# Altium project LightMusicProject_r002.PrjPCB
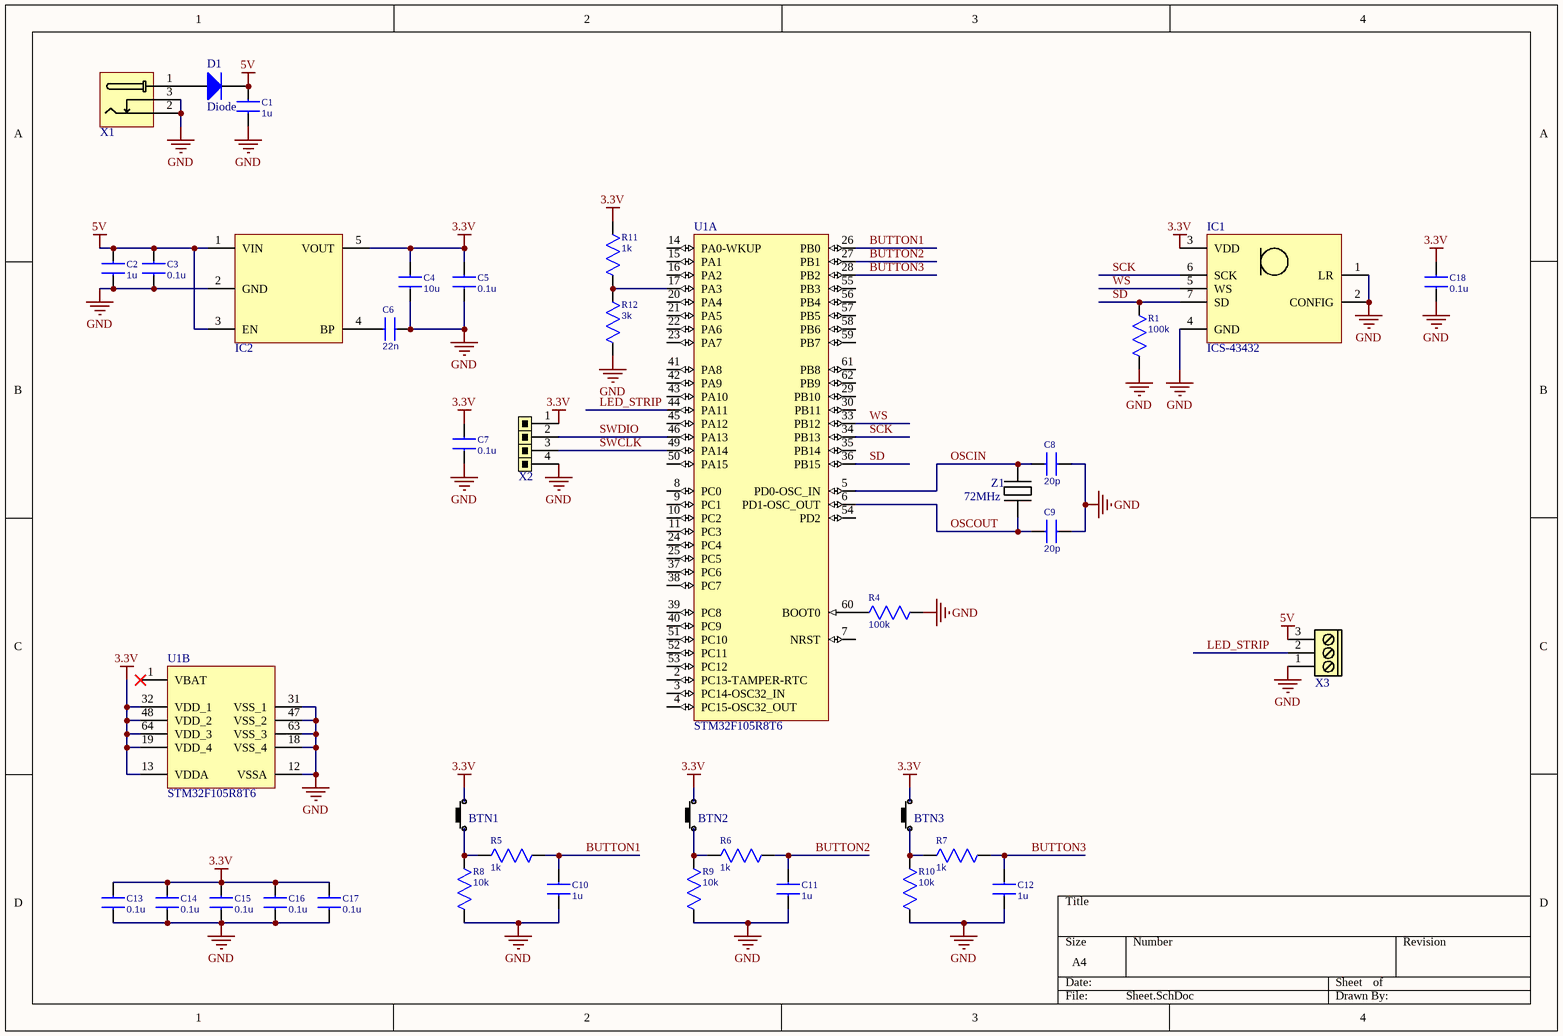
[diagram p0: Sheet.SchDoc]
1 sheet, 39 parts. Net scope: global (net labels, ports and power ports of the same name join across sheets).
Board file: PCB.PcbDoc

## Sheet Sheet.SchDoc
size A4

### Parts
BTN1  Push Button  [PUSH BUTTON]  (value not drawn)
BTN2  Push Button  [PUSH BUTTON]  (value not drawn)
BTN3  Push Button  [PUSH BUTTON]  (value not drawn)
C1  1u  [C_0805]
C2  1u  [C_0805]
C3  0.1u  [C_0603]
C4  10u  [C_0805]
C5  0.1u  [C_0603]
C6  22n  [C_0603]
C7  0.1u  [C_0603]
C8  20p  [C_0603]
C9  20p  [C_0603]
C10  1u  [C_0603]
C11  1u  [C_0603]
C12  1u  [C_0603]
C13  0.1u  [C_0603]
C14  0.1u  [C_0603]
C15  0.1u  [C_0603]
C16  0.1u  [C_0603]
C17  0.1u  [C_0603]
C18  0.1u  [C_0603]
D1  Diode  [SMC]
IC1  ICS-43432  [ICS-43432]
IC2  RT9193  [SOT23]  (value not drawn)
R1  100k  [R_0603]
R4  100k  [R_0603]
R5  1k  [R_0603]
R6  1k  [R_0603]
R7  1k  [R_0603]
R8  10k  [R_0603]
R9  10k  [R_0603]
R10  10k  [R_0603]
R11  1k  [R_0603]
R12  3k  [R_0603]
U1  STM32F105R8T6  [STM-LQFP64_N]  (parts A,B of 2)
X1  Jack Female  [DC-140]  (value not drawn)
X2  PLS-4  [PLS-4]  (value not drawn)
X3  DG-300-3  [YH-XH-3]  (value not drawn)
Z1  72MHz  [HC-49]

### Nets
3.3V: BTN1.2 BTN2.2 BTN3.2 C4.2 C5.1 C7.1 C13.1 C14.1 C15.1 C16.1 C17.1 C18.1 IC1.3(VDD) IC2.5(VOUT) R11.2 U1.13(VDDA) U1.19(VDD_4) U1.32(VDD_1) U1.48(VDD_2) U1.64(VDD_3) X2.1
5V: C1.2 C2.2 C3.2 D1.2(K) IC2.1(VIN) IC2.3(EN) X3.3
GND: C1.1 C2.1 C3.1 C4.1 C5.2 C6.2 C7.2 C8.1 C9.1 C10.1 C11.1 C12.1 C13.2 C14.2 C15.2 C16.2 C17.2 C18.2 IC1.1(LR) IC1.2(CONFIG) IC1.4(GND) IC2.2(GND) R1.2 R4.1 R8.1 R9.1 R10.1 R12.1 U1.12(VSSA) U1.18(VSS_4) U1.31(VSS_1) U1.47(VSS_2) U1.63(VSS_3) X1.2 X1.3 X2.4 X3.1
BUTTON1: C10.2 R5.2 U1.26(PB0)
BUTTON2: C11.2 R6.2 U1.27(PB1)
BUTTON3: C12.2 R7.2 U1.28(PB2)
LED_STRIP: U1.44(PA11) X3.2
OSCIN: C8.2 U1.5(PD0-OSC_IN) Z1.2
OSCOUT: C9.2 U1.6(PD1-OSC_OUT) Z1.1
SCK: IC1.6(SCK) U1.34(PB13)
SD: IC1.7(SD) R1.1 U1.36(PB15)
SWCLK: U1.49(PA14) X2.3
SWDIO: U1.46(PA13) X2.2
WS: IC1.5(WS) U1.33(PB12)
NetBTN1_1: BTN1.1 R5.1 R8.2
NetBTN2_1: BTN2.1 R6.1 R9.2
NetBTN3_1: BTN3.1 R7.1 R10.2
NetC6_1: C6.1 IC2.4(BP)
NetD1_1: D1.1(A) X1.1
NetR4_2: R4.2 U1.60(BOOT0)
NetR11_1: R11.1 R12.2 U1.17(PA3)

Not connected (* = marked no-connect by the designer): U1 1(VBAT)* 2(PC13-TAMPER-RTC) 3(PC14-OSC32_IN) 4(PC15-OSC32_OUT) 7(NRST) 8(PC0) 9(PC1) 10(PC2) 11(PC3) 14(PA0-WKUP) 15(PA1) 16(PA2) 20(PA4) 21(PA5) 22(PA6) 23(PA7) 24(PC4) 25(PC5) 29(PB10) 30(PB11) 35(PB14) 37(PC6) 38(PC7) 39(PC8) 40(PC9) 41(PA8) 42(PA9) 43(PA10) 45(PA12) 50(PA15) 51(PC10) 52(PC11) 53(PC12) 54(PD2) 55(PB3) 56(PB4) 57(PB5) 58(PB6) 59(PB7) 61(PB8) 62(PB9)

### Library data of the parts
C1 C2 C4 = C0805: Capacitor
  C1 C2: Value: 1u
  C4: Value: 10u
C3 C5-C18 = C0603: Capacitor
  C3 C5 C7 C13-C18: Value: 0.1u
  C6: Value: 22n
  C8 C9: Value: 20p
  C10-C12: Value: 1u
D1 = Diode: Default Diode; Published: 8-Jun-2000; LatestRevisionDate: 17-Jul-2002; LatestRevisionNote: Re-released for DXP Platform.; PackageVersion: Sep-1996; PackageReference: SMC; Publisher: Altium Limited; PackageDescription: DO-214-AB/SMC; 2 C-Bend Leads; Body 7.9 x 5.9 mm, inc. leads (LxW); Code_JEDEC: DO-214-AB
IC1 = ICS-43432: Low-Noise Microphone with I2  S Digital Output
IC2 = RT9193: 300mA, CMOS LDO Regulator
R1 R4-R12 = R0603: Resistor
  R1 R4: Value: 100k
  R5-R7 R11: Value: 1k
  R8-R10: Value: 10k
  R12: Value: 3k
U1 = STM32F105R8T6: ARM Cortex-M3 32-bit MCU, 64 KB Flash, 64 KB Internal RAM, 51 I/Os, 64-pin LQFP, -40 to 85 degC, Tray; A/D Converter: 2x12-bit (16 Channel); D/A Converter: 2x12-bit (2 Channel); FLASH Size (Prog) (kB): 64; I/Os (High Current): 51; Operating Frequency(F) (Processor speed) (MHz): 72; Supply Voltage(Vcc) min (V): 2; DatasheetVersion: Rev. 6; PackageVersion: Rev. 4, 06/2013; PackageReference: LQFP64; PackageDescription: 64-Pin Low Profile Quad Flat Package, 10 x 10 mm Body, 0.5 mm Pitch; Supplier 1: Digi-Key; Supplier Part Number 1: 497-8922-ND; Supplier 2: Farnell; Supplier Part Number 2: 1737131; Supplier 3: Newark; Supplier Part Number 3: 52R2327; Supplier 4: Newark; Supplier Part Number 4: 25R9439; Supplier 5: Mouser; Supplier Part Number 5: 511-STM32F105R8T6; Core: ARM Cortex-M3; Internal RAM Size (kB): 64; Packing: Tray; Mounting Technology: Surface Mount; PartNumber: STM32F105R8T6; ComponentLink1Description: Manufacturer URL; ComponentLink1URL: http://www.st.com/web/en/home.html; ComponentLink2Description: Datasheet; ComponentLink2URL: http://www.st.com/st-web-ui/static/active/en/resource/technical/document/datasheet/CD00220364.pdf; ComponentLink3Description: Package Specification; ComponentLink3URL: http://www.st.com/st-web-ui/static/active/en/resource/technical/document/datasheet/DM00037051.pdf
Z1 = XTAL: Quartz resonator